# EAGLE design MucDuino_Cherry (EAGLE 6.5.0)
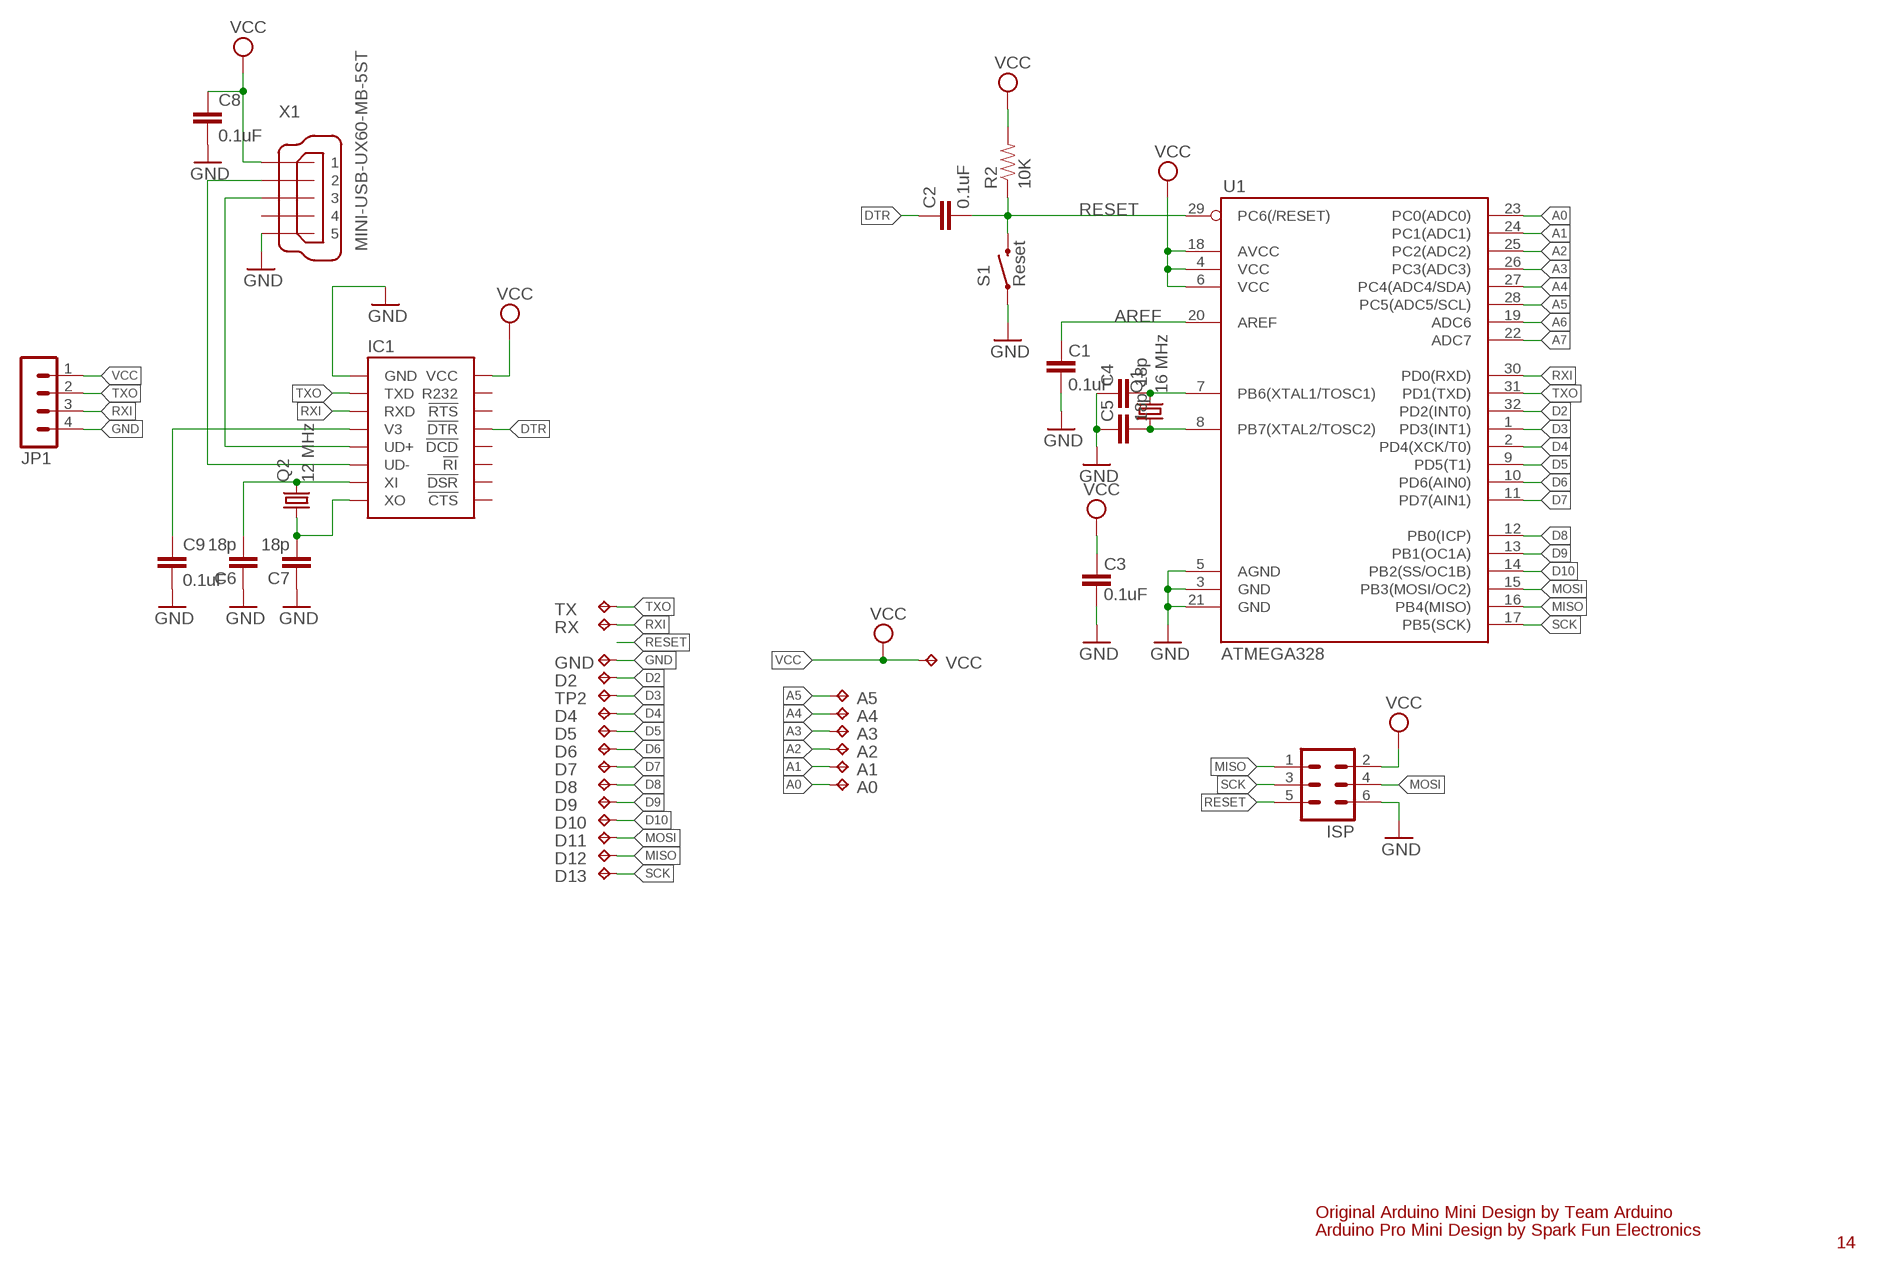
[diagram p0: schematic, sheet 1]

## Parts
A0  TPPAD1-13  [P1-13]
A1  TPPAD1-13  [P1-13]
A2  TPPAD1-13  [P1-13]
A3  TPPAD1-13  [P1-13]
A4  TPPAD1-13  [P1-13]
A5  TPPAD1-13  [P1-13]
C1  0.1uF  CAP0603-CAP  [0603-CAP]
C2  0.1uF  CAP0603-CAP  [0603-CAP]
C3  0.1uF  CAP0603-CAP  [0603-CAP]
C4  18p  CAP0603-CAP  [0603-CAP]
C5  18p  CAP0603-CAP  [0603-CAP]
C6  18p  CAP0603-CAP  [0603-CAP]
C7  18p  CAP0603-CAP  [0603-CAP]
C8  0.1uF  CAP0603-CAP  [0603-CAP]
C9  0.1uF  CAP0603-CAP  [0603-CAP]
D2  TPPAD1-13  [P1-13]
D4  TPPAD1-13  [P1-13]
D5  TPPAD1-13  [P1-13]
D6  TPPAD1-13  [P1-13]
D7  TPPAD1-13  [P1-13]
D8  TPPAD1-13  [P1-13]
D9  TPPAD1-13  [P1-13]
D10  TPPAD1-13  [P1-13]
D11  TPPAD1-13  [P1-13]
D12  TPPAD1-13  [P1-13]
D13  TPPAD1-13  [P1-13]
GND  TPPAD1-13  [P1-13]
IC1  CH340G  [SOP16-209MM]
ISP  MA03-2  [MA03-2]
JP1  MA04-1  [MA04-1]
Q1  16 MHz  CRYSTALHC49UP  [HC49UP]
Q2  12 MHz  CRYSTALHC49UP  [HC49UP]
R2  10K  RESISTOR0603-RES  [0603-RES]
RX  TPPAD1-13  [P1-13]
S1  Reset  SWITCH-MOMENTARY-2SMD-ALT01  [TACTILE-SWITCH-SMD-ALT01]
TP2  TPPAD1-13  [P1-13]
TX  TPPAD1-13  [P1-13]
U1  ATMEGA328  ATMEGA168  [TQFP32-08]
VCC  TPPAD1-13  [P1-13]
X1  MINI-USB-UX60-MB-5ST  [UX60-MB-5ST]

## Nets
A0: A0.TP U1.23(PC0(ADC0))
A1: A1.TP U1.24(PC1(ADC1))
A2: A2.TP U1.25(PC2(ADC2))
A3: A3.TP U1.26(PC3(ADC3))
A4: A4.TP U1.27(PC4(ADC4/SDA))
A5: A5.TP U1.28(PC5(ADC5/SCL))
A6: U1.19(ADC6)
A7: U1.22(ADC7)
AREF: C1.2 U1.20(AREF)
D2: D2.TP U1.32(PD2(INT0))
D3: TP2.TP U1.1(PD3(INT1))
D4: D4.TP U1.2(PD4(XCK/T0))
D5: D5.TP U1.9(PD5(T1))
D6: D6.TP U1.10(PD6(AIN0))
D7: D7.TP U1.11(PD7(AIN1))
D8: D8.TP U1.12(PB0(ICP))
D9: D9.TP U1.13(PB1(OC1A))
D10: D10.TP U1.14(PB2(SS/OC1B))
DTR: C2.2 IC1.P$13(!DTR)
GND [vcc]: C1.1 C3.1 C4.2 C5.2 C6.2 C7.2 C8.2 C9.2 GND.TP IC1.P$1(GND) ISP.6 JP1.4 S1.1 S1.2 U1.3(GND) U1.5(AGND) U1.21(GND) X1.5
MISO: D12.TP ISP.1 U1.16(PB4(MISO))
MOSI: D11.TP ISP.4 U1.15(PB3(MOSI/OC2))
N$1: C5.1 Q1.1 U1.8(PB7(XTAL2/TOSC2))
N$2: C4.1 Q1.2 U1.7(PB6(XTAL1/TOSC1))
N$3: C9.1 IC1.P$4(V3)
N$5: C6.1 IC1.P$7(XI) Q2.2
N$6: C7.1 IC1.P$8(XO) Q2.1
N$8: IC1.P$5(UD+) X1.3
N$9: IC1.P$6(UD-) X1.2
RESET: C2.1 ISP.5 R2.1 S1.3 S1.4 U1.29(PC6(/RESET))
RXI: IC1.P$3(RXD) JP1.3 RX.TP U1.30(PD0(RXD))
SCK: D13.TP ISP.3 U1.17(PB5(SCK))
TXO: IC1.P$2(TXD) JP1.2 TX.TP U1.31(PD1(TXD))
VCC: C3.2 C8.1 IC1.P$16(VCC) ISP.2 JP1.1 R2.2 U1.4(VCC) U1.6(VCC) U1.18(AVCC) VCC.TP X1.1
Unconnected: IC1.P$9(!CTS) IC1.P$10(!DSR) IC1.P$11(!RI) IC1.P$12(!DCD) IC1.P$14(!RTS) IC1.P$15(R232) X1.4

## Notes on the sheet
- Original Arduino Mini Design by Team Arduino
- Arduino Pro Mini Design by Spark Fun Electronics
- 14

## Library data of the parts
A0 A1-A5 D2 D4-D13 GND RX TP2 TX VCC = testpad:TP: Test pad
C1-C9 = SparkFun:CAP: Capacitor Standard 0603 ceramic capacitor, and 0.1" leaded capacitor.
IC1 = densikit:CH340
ISP = con-lstb:MA03-2: PIN HEADER; OC_FARNELL: unknown; OC_NEWARK: unknown
JP1 = con-lstb:MA04-1: PIN HEADER; OC_FARNELL: unknown; OC_NEWARK: unknown
Q1 Q2 = crystal:CRYSTAL: CRYSTAL; OC_FARNELL: unknown; OC_NEWARK: unknown
R2 = SparkFun:RESISTOR: Resistor Basic schematic elements and footprints for 0603, 1206, and PTH resistors.
S1 = Testing:SWITCH-MOMENTARY-2: Various NO switches- pushbuttons, reed, etc
U1 = SparkFun:ATMEGA168
X1 = con-hirose:MINI-USB-: MINI USB Connector Source: http://www.hirose.co.jp/cataloge_hp/e24000019.pdf; OC_FARNELL: unknown; OC_NEWARK: unknown

## Net classes
0 default: width 0.203 mm
1 vcc: width 0.254 mm

## Board
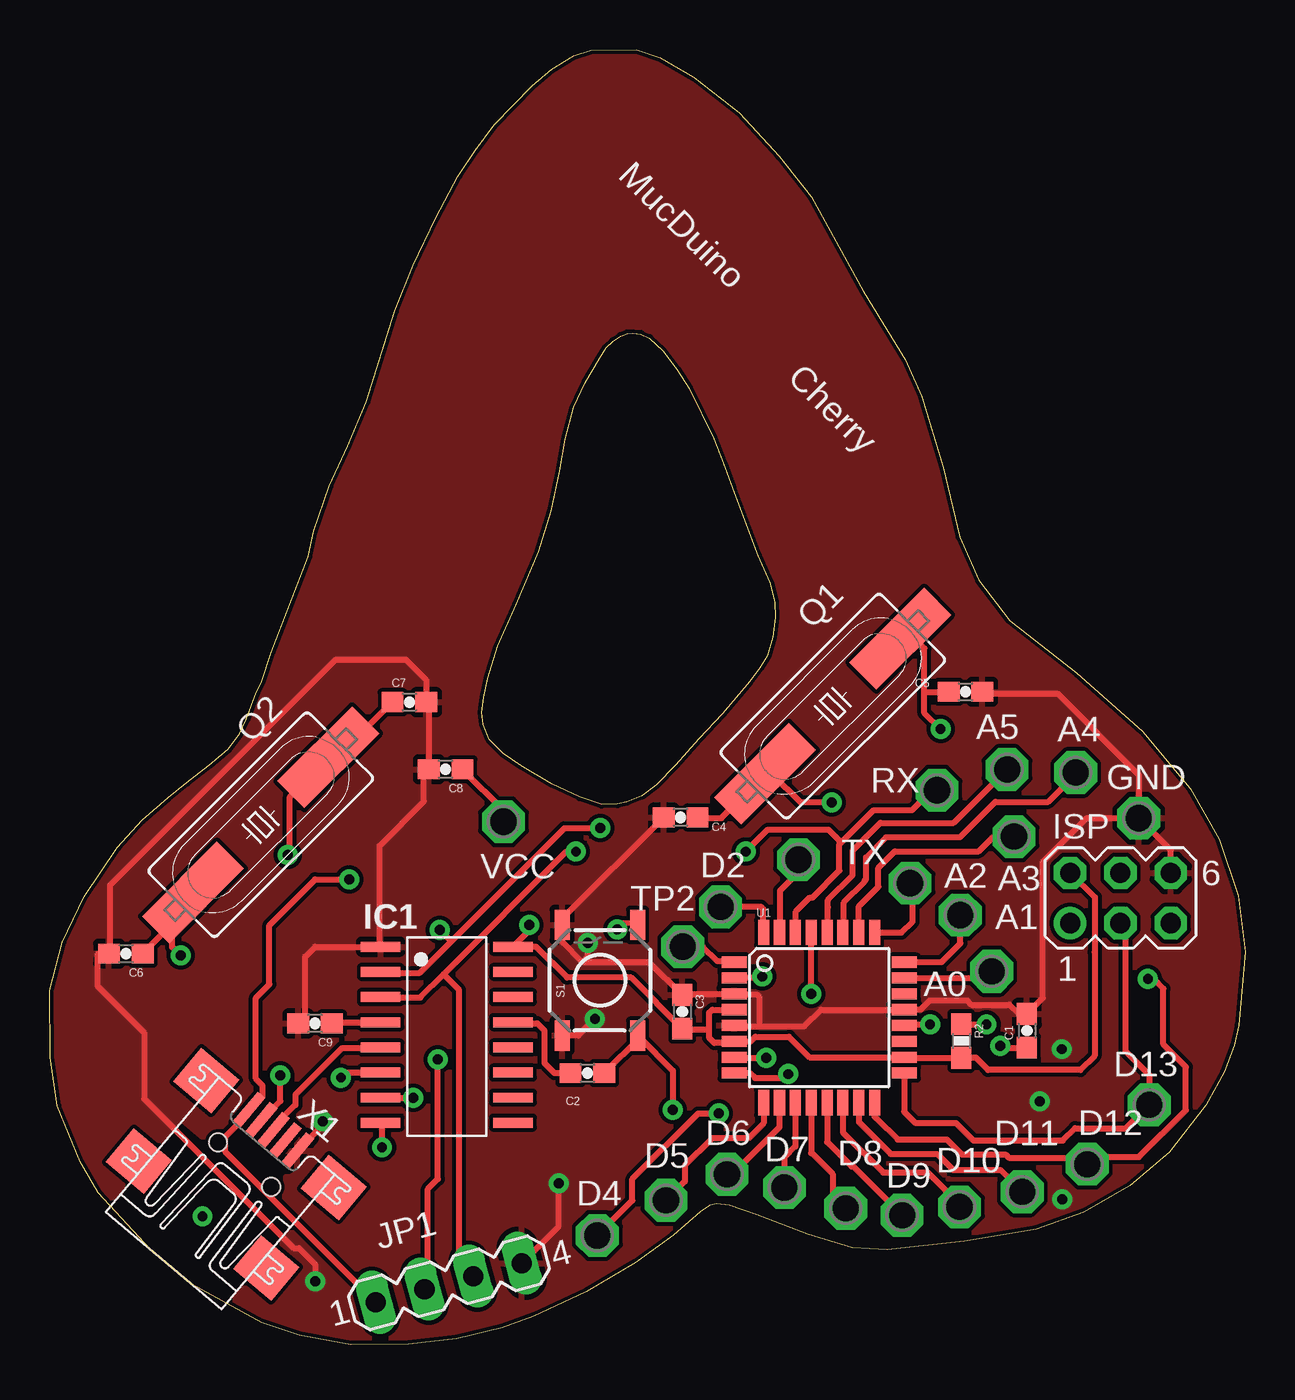
[diagram p1: board, top side]
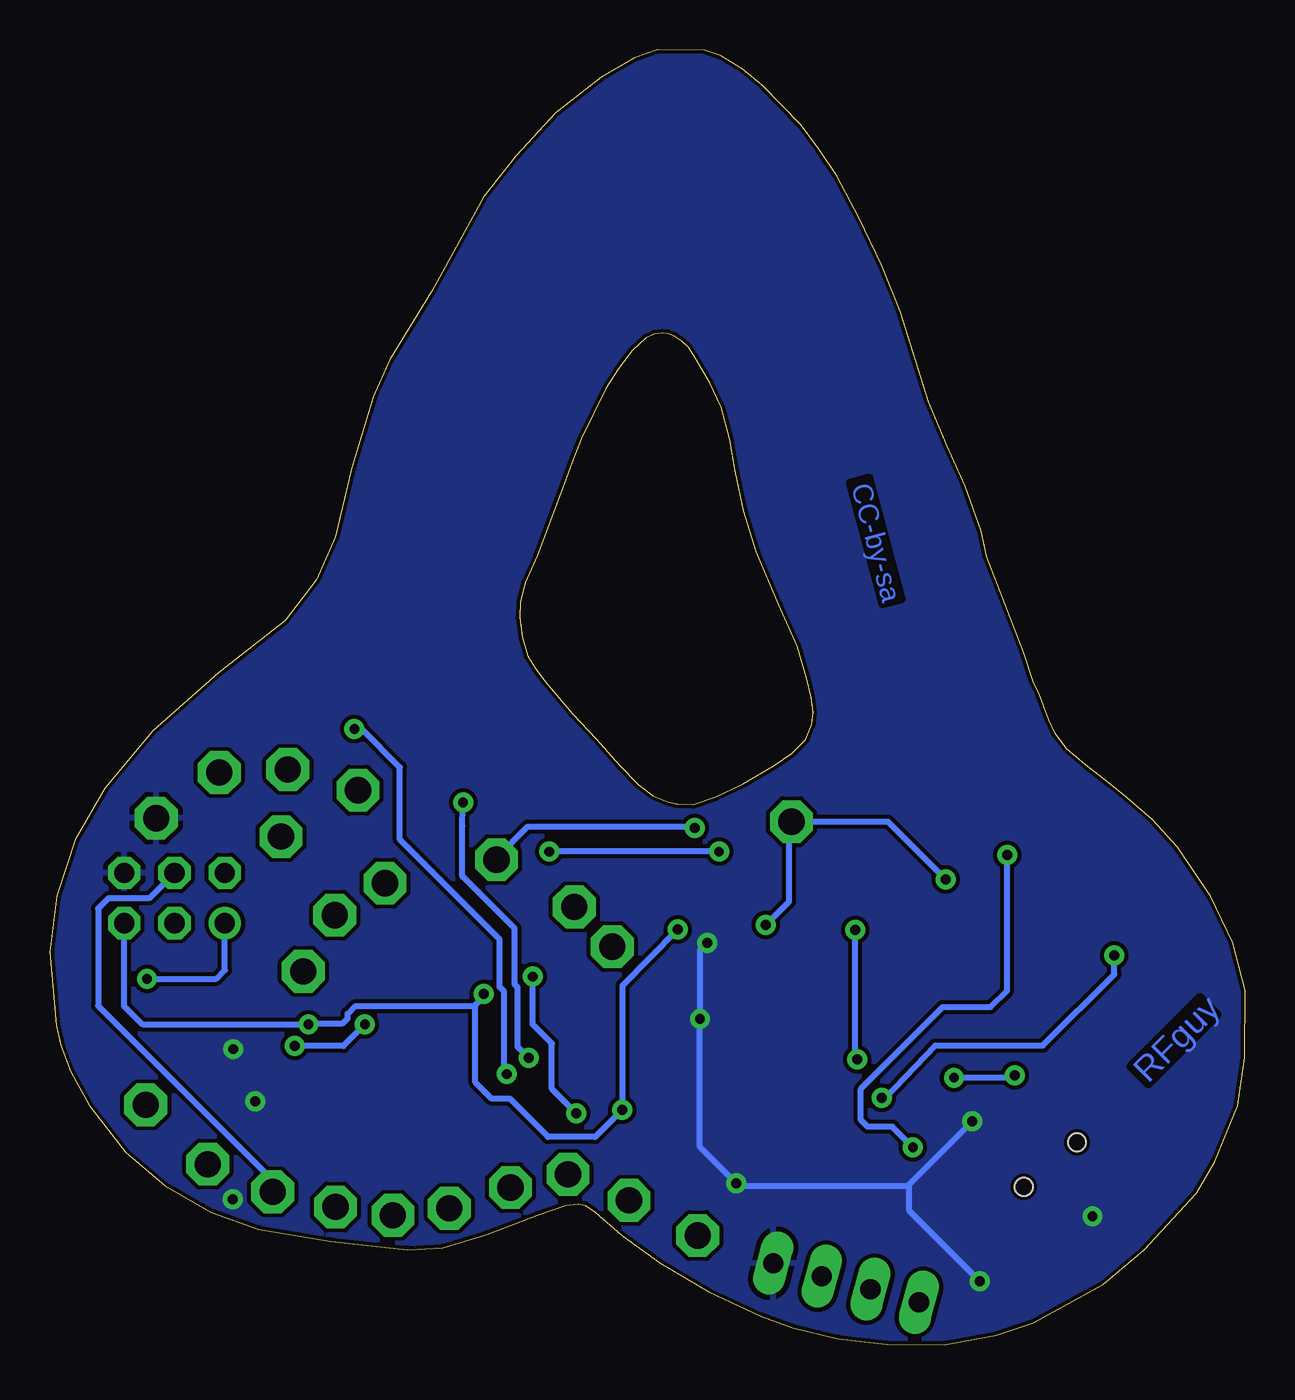
[diagram p2: board, bottom side, seen from below]

Size 60.36 x 65.39 mm. Coordinates in mm from the lower left corner, seen from the top.
Outline: 9.94,31.57 10.44,32.93 10.68,33.41 11.2,34.95 13.06,39.8 13.34,41.08 14.13,43.34 15.05,45.37 15.99,47.59 17.43,52.18 18.36,54.51 19.49,56.87 20.63,59.01 21.5,60.34 22.44,61.6 24.36,63.55 25.36,64.39 26.47,65.08 27.31,65.36 29.65,65.39 30.82,64.98 32.52,63.99 34.81,62.2 36.83,60 38.44,57.96 41.08,53.19 43.19,49.74 44.03,47.86 45.11,44.29 45.93,40.78 46.9,38.6 48.46,36.57 51.85,33.9 55.16,30.98 57.58,28.07 59.05,25.51 60,22.66 60.36,19.82 60.02,16.12 59.79,15.11 59.29,13.78 58.35,12.07 56.52,9.71 54.51,8.01 52.2,6.67 49.8,5.83 46.17,5.22 42.29,4.79 40.52,4.9 38.27,5.57 35.69,6.56 34.3,7.03 33.67,7.1 33.33,7.04 32.84,6.7 31.47,5.53 29.55,4.12 27.1,2.66 24.45,1.42 22.84,0.86 20.55,0.3 18.11,0.01 15.2,0 12.61,0.47 10.71,1.1 7.18,3.04 5.12,4.79 2.47,7.66 1.54,9.24 0.4,12.06 0.03,14.5 0,17.88 0.65,20.31 1.75,22.64 3.42,25.09 4.68,26.49 5.99,27.63 6.93,28.38 8.06,29.27 9.03,30.08 9.6,30.85 9.94,31.57
Outline: 26.46,47.34 27.04,48.58 27.77,49.82 28.1,50.34 28.45,50.67 28.82,50.93 29.15,51.05 29.44,51.07 29.85,51.03 30.27,50.82 30.94,50.18 31.65,49.25 32.28,48.26 33.52,45.75 34.01,44.5 34.45,43.26 35.01,41.79 35.75,39.85 36.35,38.48 36.6,37.49 36.63,36.7 36.5,35.72 36.23,34.78 35.84,34.16 35.34,33.47 33.96,31.84 32.76,30.57 31.59,29.25 30.63,28.26 29.88,27.71 29.14,27.4 28.66,27.29 27.86,27.27 26.76,27.64 25.36,28.32 23.79,29.23 22.91,29.85 22.2,30.55 21.88,31.32 21.82,31.92 21.92,32.67 22.13,33.63 22.62,35.27 23.55,37.37 24.69,40.03 25.32,42.08 25.75,44.11 26.04,45.73 26.46,47.34
Copper layers (1*16): Top 0.035mm / dielectric 1.5mm / Bottom 0.035mm
Design rules "SparkFun-2-layer *": minimum track width 7mil, minimum drill 15mil, track to track 8mil, track to pad 8mil, pad to pad 8mil, via to via 8mil, smd to smd 8mil, copper to edge 8mil, drill to drill 8mil, minimum pad ring 12mil, minimum via ring 10mil, stop-mask expansion 4mil, vias tented up to drill 20mil, thermal gap 10mil

### Footprints (pad centres in the part's own frame; a part is rotated, then mirrored left to right if it is on the bottom)
P1-13 = drill 1.321 pad 2.159 octagon: TP 0,0
0603-CAP = smd 1.1 x 1: 1 -0.85,0; 2 0.85,0
SOP16-209MM = smd 2 x 0.5: P$1 -3.34,4.54; P$2 -3.34,3.27; P$3 -3.34,2; P$4 -3.34,0.73; P$5 -3.34,-0.54; P$6 -3.34,-1.81; P$7 -3.34,-3.08; P$8 -3.34,-4.35; P$9 3.34,-4.35; P$10 3.34,-3.08; P$11 3.34,-1.81; P$12 3.34,-0.54; P$13 3.34,0.73; P$14 3.34,2; P$15 3.34,3.27; P$16 3.34,4.54
MA03-2 = drill 1.016: 1 -2.54,-1.27 | drill 1.016 octagon: 2 -2.54,1.27; 3 0,-1.27; 4 0,1.27; 5 2.54,-1.27; 6 2.54,1.27
MA04-1 = drill 1.016 long: 1 -3.81,0; 2 -1.27,0; 3 1.27,0; 4 3.81,0
HC49UP = smd 5.334 x 1.93: 1 -4.826,0; 2 4.826,0
0603-RES = smd 1.1 x 1: 1 -0.85,0; 2 0.85,0
TACTILE-SWITCH-SMD-ALT01 = smd 1.524 x 0.762: 1 -2.794,1.905; 2 2.794,1.905; 3 -2.794,-1.905; 4 2.794,-1.905
TQFP32-08 = smd 1.27 x 0.559: 1 -4.293,2.8; 2 -4.293,2; 3 -4.293,1.2; 4 -4.293,0.4; 5 -4.293,-0.4; 6 -4.293,-1.2; 7 -4.293,-2; 8 -4.293,-2.8; 17 4.293,-2.8; 18 4.293,-2; 19 4.293,-1.2; 20 4.293,-0.4; 21 4.293,0.4; 22 4.293,1.2; 23 4.293,2; 24 4.293,2.8 | smd 0.559 x 1.27: 9 -2.8,-4.293; 10 -2,-4.293; 11 -1.2,-4.293; 12 -0.4,-4.293; 13 0.4,-4.293; 14 1.2,-4.293; 15 2,-4.293; 16 2.8,-4.293; 25 2.8,4.293; 26 2,4.293; 27 1.2,4.293; 28 0.4,4.293; 29 -0.4,4.293; 30 -1.2,4.293; 31 -2,4.293; 32 -2.8,4.293
UX60-MB-5ST = smd 2 x 0.5: 1 2.25,1.6; 2 2.25,0.8; 3 2.25,0; 4 2.25,-0.8; 5 2.25,-1.6 | smd 2.2 x 2.5: M1 -3.3,-4.2; M2 -3.3,4.2; M3 2,4.2; M4 2,-4.2 | hole 0.9: 0,-1.75; 0,1.75

### Placement (x,y rotation side)
A0  47.55,18.85 270 top
A1  45.96,21.68 270 top
A2  43.43,23.3 270 top
A3  48.68,25.65 270 top
A4  51.8,28.89 270 top
A5  48.33,29.04 270 top
C1  49.33,15.84 270 top
C2  27.15,13.71 180 top
C3  31.93,16.8 270 top
C4  31.85,26.62 180 top
C5  46.23,32.96 0 top
C6  3.85,19.74 180 top
C7  18.16,32.44 0 top
C8  19.99,29.05 180 top
C9  13.4,16.22 180 top
D2  33.87,22.1 270 top
D4  27.65,5.51 270 top
D5  31.11,7.28 270 top
D6  34.19,8.6 270 top
D7  37.09,7.93 270 top
D8  40.19,6.88 270 top
D9  43.03,6.53 270 top
D10  45.93,6.95 270 top
D11  49.1,7.72 270 top
D12  52.37,9.11 270 top
D13  55.51,12.11 270 top
GND  54.98,26.58 270 top
IC1  20.05,15.55 0 top
ISP  54.05,22.55 0 top
JP1  20.15,3.13 15 top
Q1  39.53,32.23 225 top
Q2  10.66,26.25 225 top
R2  46.02,15.33 270 top
RX  44.79,27.99 270 top
S1  27.78,18.4 90 top
TP2  31.96,20.09 270 top
TX  37.8,24.48 270 top
U1  38.84,16.51 0 top
VCC  22.91,26.4 270 top
X1  9.84,9.09 50 top

### Tracks (layer width: path | path; a pad name or v marks a point on that pad's centre or on a via)
A0
  Top 0.305: U1.23 47.08,18.51 47.61,19.04 47.61,18.86 47.67,18.8 47.6,18.8 A0.TP
A1
  Top 0.305: U1.24 45.02,19.31 45.97,20.26 45.97,21.66 A1.TP
A2
  Top 0.305: U1.25 43.01,20.8 43.56,21.35 43.56,23.31 43.55,23.3 A2.TP
A3
  Top 0.305: U1.26 40.85,22.13 41.83,23.11 41.83,24.07 42.67,24.91 46.89,24.91 47.57,25.59 48.79,25.59 48.73,25.65 A3.TP
A4
  Top 0.305: U1.27 40.09,20.85 40.09,22.32 41.14,23.37 41.14,23.43 41.21,23.5 41.21,24.6 42.23,25.62 45.96,25.62 47.74,27.4 50.4,27.4 51.8,28.8 A4.TP
A5
  Top 0.305: U1.28 39.29,20.85 39.29,22.07 39.28,22.08 39.28,22.45 40.53,23.7 40.53,24.94 41.93,26.34 45.63,26.34 A5.TP
AREF  (via drill 0.5)
  Top 0.305: U1.20 43.19,16.17 v44.44,16.17 | v47.99,15.08 48.08,14.99 C1.2
  Bottom 0.305: v44.44,16.17 45.53,15.08 v47.99,15.08
D2
  Top 0.305: U1.32 36.03,20.82 36.03,21.98 35.91,22.1 D2.TP
D3
  Top 0.305: U1.1 34.51,19.35 33.72,19.35 32.98,20.09 TP2.TP
D4  (via drill 0.5)
  Top 0.305: D4.TP 29.42,7.28 29.42,8.36 32.73,11.67 v33.77,11.67 | v35.98,18.58 35.91,18.51 U1.2
  Bottom 0.305: v33.77,11.67 35.01,12.91 35.01,15.2 35.98,16.17 v35.98,18.58
D5
  Top 0.305: U1.9 36.04,11.18 35.28,10.42 33.44,10.42 32.07,9.05 32.07,8.24 D5.TP
D6
  Top 0.305: U1.10 36.84,10.98 34.5,8.64 34.23,8.64 D6.TP
D7
  Top 0.305: U1.11 37.64,10 37.07,9.43 37.07,7.95 D7.TP
D8
  Top 0.305: U1.12 38.44,9.68 38.51,9.61 38.54,9.61 39.53,8.62 39.53,7.54 D8.TP
D9
  Top 0.305: U1.13 39.24,10.24 40.48,9 40.56,9 D9.TP
D10
  Top 0.305: U1.14 40.04,10.72 42.07,8.69 44.32,8.69 46.09,6.92 45.96,6.92 D10.TP
DTR
  Top 0.305: IC1.P$13 23.45,16.22 24.61,16.22 24.97,15.86 24.97,14.22 25.48,13.71 C2.2
GND  (via drill 0.5)
  Top 0.305: ISP.6 56.59,24.97 GND.TP | U1.5 34.59,16.07 35.82,16.07 | 35.82,16.07 38.1,16.07 38.94,16.91 U1.21 43.97,16.92 44.42,17.37 46.32,17.37 46.53,17.16 48.45,17.16 48.92,16.69 C1.1 50.13,17.5 50.13,24.37 52.34,26.58 GND.TP | 35.82,16.07 35.82,17.55 35.69,17.68 34.58,17.68 U1.3 31.99,17.71 C3.1 30.27,19.31 26.89,19.31 | C5.2 47.17,32.87 50.88,32.87 54.98,28.77 GND.TP | C4.2 25.94,21.56 25.94,20.95 25.87,21.02 | 25.87,21.02 S1.2 | 26.89,19.31 25.87,20.33 25.87,21.02 | 12.5,16.27 C9.2 12.9,16.57 12.9,19.58 13.41,20.09 IC1.P$1 16.66,20.14 16.66,25.19 18.9,27.43 18.9,29.04 18.91,29.05 C8.2 19.14,32.31 C7.2 19.01,33.56 17.98,34.59 14.45,34.59 3.06,23.2 3.06,19.8 C6.2 2.46,19.74 2.44,19.72 2.44,18.08 4.78,15.74 4.78,12.42 12.33,4.87 12.6,4.87 13.41,4.06 v13.41,3.2 | JP1.4 25.7,5.98 v25.7,8.15 | v27.53,16.44 26.69,15.6 S1.1 | 26.89,19.31 27.17,19.59 v27.17,20.29 | X1.5 13.79,11.07 v13.79,11.27
  Bottom 0.305: v27.17,20.29 27.53,19.93 v27.53,16.44 27.53,9.98 v25.7,8.15 25.7,8 17.06,8 16.96,8.09 | v13.79,11.27 16.96,8.09 | v13.41,3.2 16.96,6.75 16.96,8.09
  other vias: 51.08,14.92 49.98,12.29 51.12,7.34 7.72,6.47
  pour Bottom: -9.19,69.49 66.98,69.49 66.98,-4.26 -9.19,-4.26
  pour Top: -7.27,69.64 67.97,69.64 67.97,-0.87 -7.27,-0.87
MISO  (via drill 0.5)
  Top 0.305: U1.16 41.64,11.51 41.75,11.4 41.76,11.4 42.8,10.36 45.29,10.36 46.05,9.6 48.25,9.6 48.41,9.44 52.04,9.44 | 52.04,9.44 D12.TP | 52.04,9.44 52.07,9.47 54.98,9.47 57.35,11.84 57.35,14.02 56.22,15.15 56.22,17.97 55.73,18.46 v55.44,18.46
  Bottom 0.305: v55.44,18.46 v55.43,18.47 51.95,18.47 51.51,18.91 ISP.1
MOSI
  Top 0.305: U1.15 40.84,11.24 42.45,9.63 44.8,9.63 45.61,8.82 48,8.82 D11.TP
  Bottom 0.305: ISP.4 55.33,22.54 57.39,22.54 57.91,22.02 57.91,17.11 49.11,8.31 49.11,7.56 49.1,7.57 D11.TP
N$1  (via drill 0.5)
  Top 0.305: U1.8 34.6,13.66 34.66,13.72 35.35,13.72 35.61,13.46 37.09,13.46 v37.29,13.66 | v44.97,31.08 44.16,31.89 44.16,32.92 | 44.16,32.92 44.16,35.15 43.66,35.65 Q1.1 | C5.1 45.34,32.92 44.16,32.92
  Bottom 0.305: v37.29,13.66 37.46,13.83 37.42,13.87 37.42,17.83 37.64,18.05 37.64,20.46 42.68,25.5 42.68,29.15 44.61,31.08 v44.97,31.08
N$2  (via drill 0.5)
  Top 0.305: U1.7 34.58,14.48 v36.18,14.48 | v39.49,27.38 37.91,27.38 36.46,28.82 Q1.2 36.12,28.79 33.91,26.58 32.74,26.58 C4.1
  Bottom 0.305: v36.18,14.48 36.74,15.04 36.74,18.04 36.89,18.19 36.89,21.02 39.5,23.63 39.52,23.63 39.52,26.19 39.51,27.14 v39.49,27.38
N$3
  Top 0.305: C9.1 14.31,16.28 IC1.P$4
N$5  (via drill 0.5)
  Top 0.305: IC1.P$7 v18.36,12.46 | v6.62,19.65 6.19,20.08 6.19,21.84 7.04,22.69 | 7.04,22.69 7.18,22.83 Q2.2 | C6.1 6.99,22.03 6.99,22.38 7.04,22.43 7.04,22.69
  Bottom 0.305: v18.36,12.46 18.18,12.46 15.66,15.1 10.22,15.1 6.62,18.7 v6.62,19.65
N$6  (via drill 0.5)
  Top 0.305: IC1.P$8 16.78,11.13 v16.78,9.96 | v12.03,24.72 12.13,24.82 12.13,27.66 14.4,29.93 | 14.4,29.93 14.3,29.93 14.07,29.7 Q2.1 | C7.1 14.8,29.93 14.4,29.93
  Bottom 0.305: v16.78,9.96 17.82,11 19.07,11 19.41,11.34 19.41,12.91 15.28,17.04 12.86,17.04 12.03,17.87 v12.03,24.72
N$8
  Top 0.305: IC1.P$5 16.67,14.97 14.76,14.97 12.41,12.62 12.41,12.1 11.29,10.98 X1.3
N$9  (via drill 0.5)
  Top 0.305: X1.2 11.65,12.31 v11.65,13.6 | v14.71,13.48 14.97,13.74 IC1.P$6
  Bottom 0.305: v11.65,13.6 11.77,13.48 v14.71,13.48
RESET  (via drill 0.5)
  Top 0.305: R2.1 v47.29,16.17 | v38.45,17.71 38.44,19.4 U1.29 | S1.3 29.78,15.5 | 29.78,15.5 31.46,13.83 v31.46,11.85 | S1.4 29.59,21.28 28.98,21.27 v28.65,20.97 | C2.1 29.78,15.5
  Bottom 0.305: 38.87,17.16 38.92,17.1 44.92,17.1 45.32,16.7 45.32,16.46 45.56,16.22 47.44,16.22 v47.29,16.17 55.68,16.17 56.61,17.1 56.61,21.26 ISP.5 | 38.87,17.16 38.41,17.61 v38.45,17.71 | 38.87,17.16 38.87,13.25 38.03,12.41 37.11,12.41 35.19,10.49 32.82,10.49 v31.46,11.85 31.45,18.12 v28.65,20.97
RXI  (via drill 0.5)
  Top 0.305: U1.30 37.67,20.83 37.67,21.86 38.38,22.57 38.51,22.57 39.87,23.93 39.87,25.25 | 39.87,25.25 41.61,26.99 43.54,26.99 44.57,28.02 44.96,28.02 44.93,27.99 RX.TP | IC1.P$3 16.74,17.52 18.72,17.52 19.9,18.7 | 19.9,18.7 26.09,24.89 v26.57,24.89 | v35.14,24.89 36.26,26.01 39.31,26.01 39.87,25.45 39.87,25.25 | JP1.3 20.67,4.17 20.67,17.91 19.9,18.69 19.9,18.7
  Bottom 0.305: v26.57,24.89 v35.14,24.89
SCK
  Top 0.305: U1.17 43.14,11.75 43.7,11.19 45.75,11.19 46.63,10.31 51.14,10.31 51.76,10.93 54.32,10.93 D13.TP 55.51,13.61 54.3,14.82 54.3,21.03 ISP.3
TXO  (via drill 0.5)
  Top 0.305: U1.31 36.88,20.84 36.88,22.92 37.8,23.84 TX.TP | IC1.P$2 16.76,18.77 18.69,18.77 20.3,20.39 | 20.3,20.39 26,26.08 v27.79,26.08 | JP1.2 19.1,2.97 19.1,7.86 19.6,8.36 v19.6,14.4 | v19.7,20.94 20.26,20.39 20.3,20.39
  Bottom 0.305: v27.79,26.08 27.85,26.14 36.24,26.14 37.8,24.58 TX.TP | v19.6,14.4 19.7,14.5 v19.7,20.94
VCC  (via drill 0.5)
  Top 0.305: 33.29,15.92 33.29,15.49 33.55,15.23 34.47,15.23 U1.6 35.38,15.31 35.62,15.55 37.31,15.55 38.35,14.51 U1.18 43.17,14.48 R2.2 46.76,14.48 47.37,13.87 52.03,13.87 52.75,14.59 52.75,19.82 52.77,19.84 52.77,22.58 51.53,23.82 ISP.2 | 33.29,15.92 33.29,16.75 33.45,16.91 U1.4 | 33.29,15.92 31.96,15.92 C3.2 29.35,18.53 26.12,18.53 24.56,20.09 IC1.P$16 24.21,20.91 v24.21,21.19 | JP1.1 8.88,9.73 8.88,10.49 9.98,11.59 9.98,11.67 10.06,11.75 X1.1 10.76,12.54 10.76,13.07 10.41,13.42 10.41,17.51 11.09,18.19 11.09,21.17 13.41,23.49 v15.13,23.49 | C8.1 22.97,26.92 22.97,26.21 23.01,26.25 23.03,26.25 22.91,26.37 VCC.TP
  Bottom 0.305: v24.21,21.19 23.03,22.37 23.03,26.25 22.91,26.37 VCC.TP 18.04,26.4 v15.13,23.49

### Text on the board
Bottom: CC-by-sa | RFguy
tNames: MucDuino | Cherry
tValues: Valid combinations: | 168V / 3.3V Reg / 8MHz | 168 / 5V Reg / 16MHz | 168 / 5V Reg / 20MHz | Mark back accordingly | Arduino Pro Mini
209bmp: /Users/RFguy/Documents/cherry.bmp